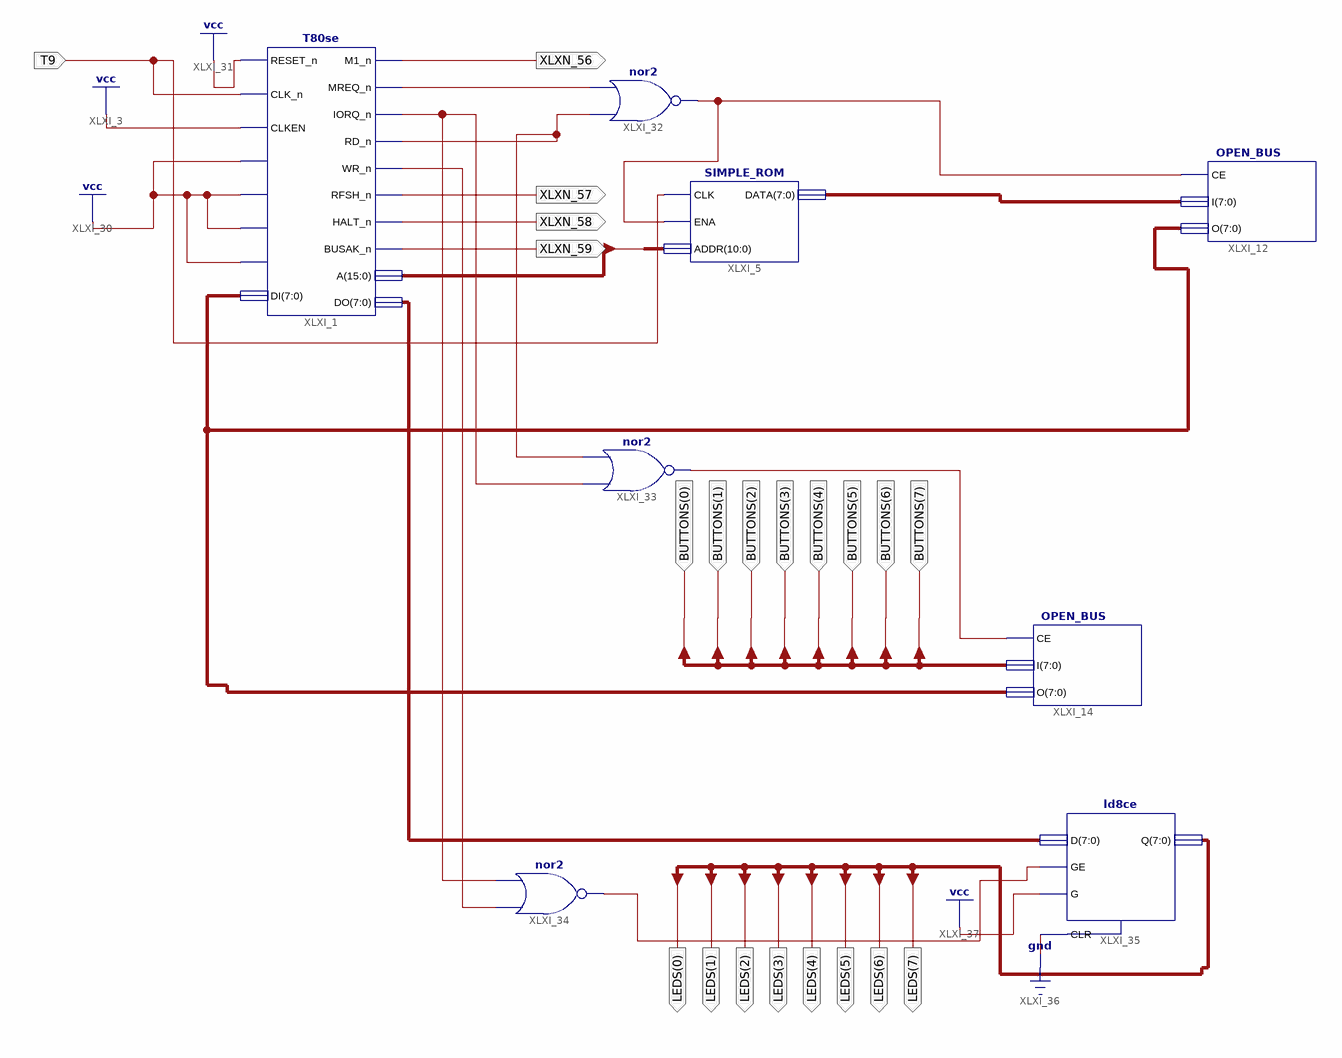
[diagram p0: schematic sheet 1]
// Xilinx ISE schematic ZAP_sans_ROM_latches.sch (spartan3) as structural Verilog: 8 symbols, 21 ports
module ZAP_sans_ROM_latches (
  input  T9,
  input  [7:0] BUTTONS,
  output XLXN_56,
  output XLXN_57,
  output XLXN_58,
  output XLXN_59,
  output [7:0] LEDS
);

  wire XLXN_10, XLXN_11, XLXN_31, XLXN_33, XLXN_83, XLXN_106, XLXN_139;
  wire [7:0] XLXN_81, XLXN_136, XLXN_138;
  wire [15:0] ADDRESSES;

  T80se XLXI_1 (
    .RESET_n(1'b1), .CLK_n(T9), .CLKEN(1'b1), .WAIT_n(1'b1), .INT_n(1'b1), .NMI_n(1'b1), .BUSRQ_n(1'b1),
    .DI(XLXN_136), .M1_n(XLXN_56), .MREQ_n(XLXN_10), .IORQ_n(XLXN_83), .RD_n(XLXN_11), .WR_n(XLXN_33),
    .RFSH_n(XLXN_57), .HALT_n(XLXN_58), .BUSAK_n(XLXN_59), .A(ADDRESSES), .DO(XLXN_81));
  SIMPLE_ROM XLXI_5 (.CLK(T9), .ENA(XLXN_139), .ADDR(ADDRESSES[10:0]), .DATA(XLXN_138));
  nor XLXI_32 (XLXN_139, XLXN_11, XLXN_10);
  OPEN_BUS XLXI_12 (.CE(XLXN_139), .I(XLXN_138), .O(XLXN_136));
  nor XLXI_34 (XLXN_106, XLXN_33, XLXN_83);
  ld8ce XLXI_35 (.CLR(1'b0), .D(XLXN_81), .G(1'b1), .GE(XLXN_106), .Q(LEDS));
  OPEN_BUS XLXI_14 (.CE(XLXN_31), .I(BUTTONS), .O(XLXN_136));
  nor XLXI_33 (XLXN_31, XLXN_83, XLXN_11);
endmodule
